# Altium schematic sheet DIfferential_Current_DAC.SchDoc
size 508 x 330 mm
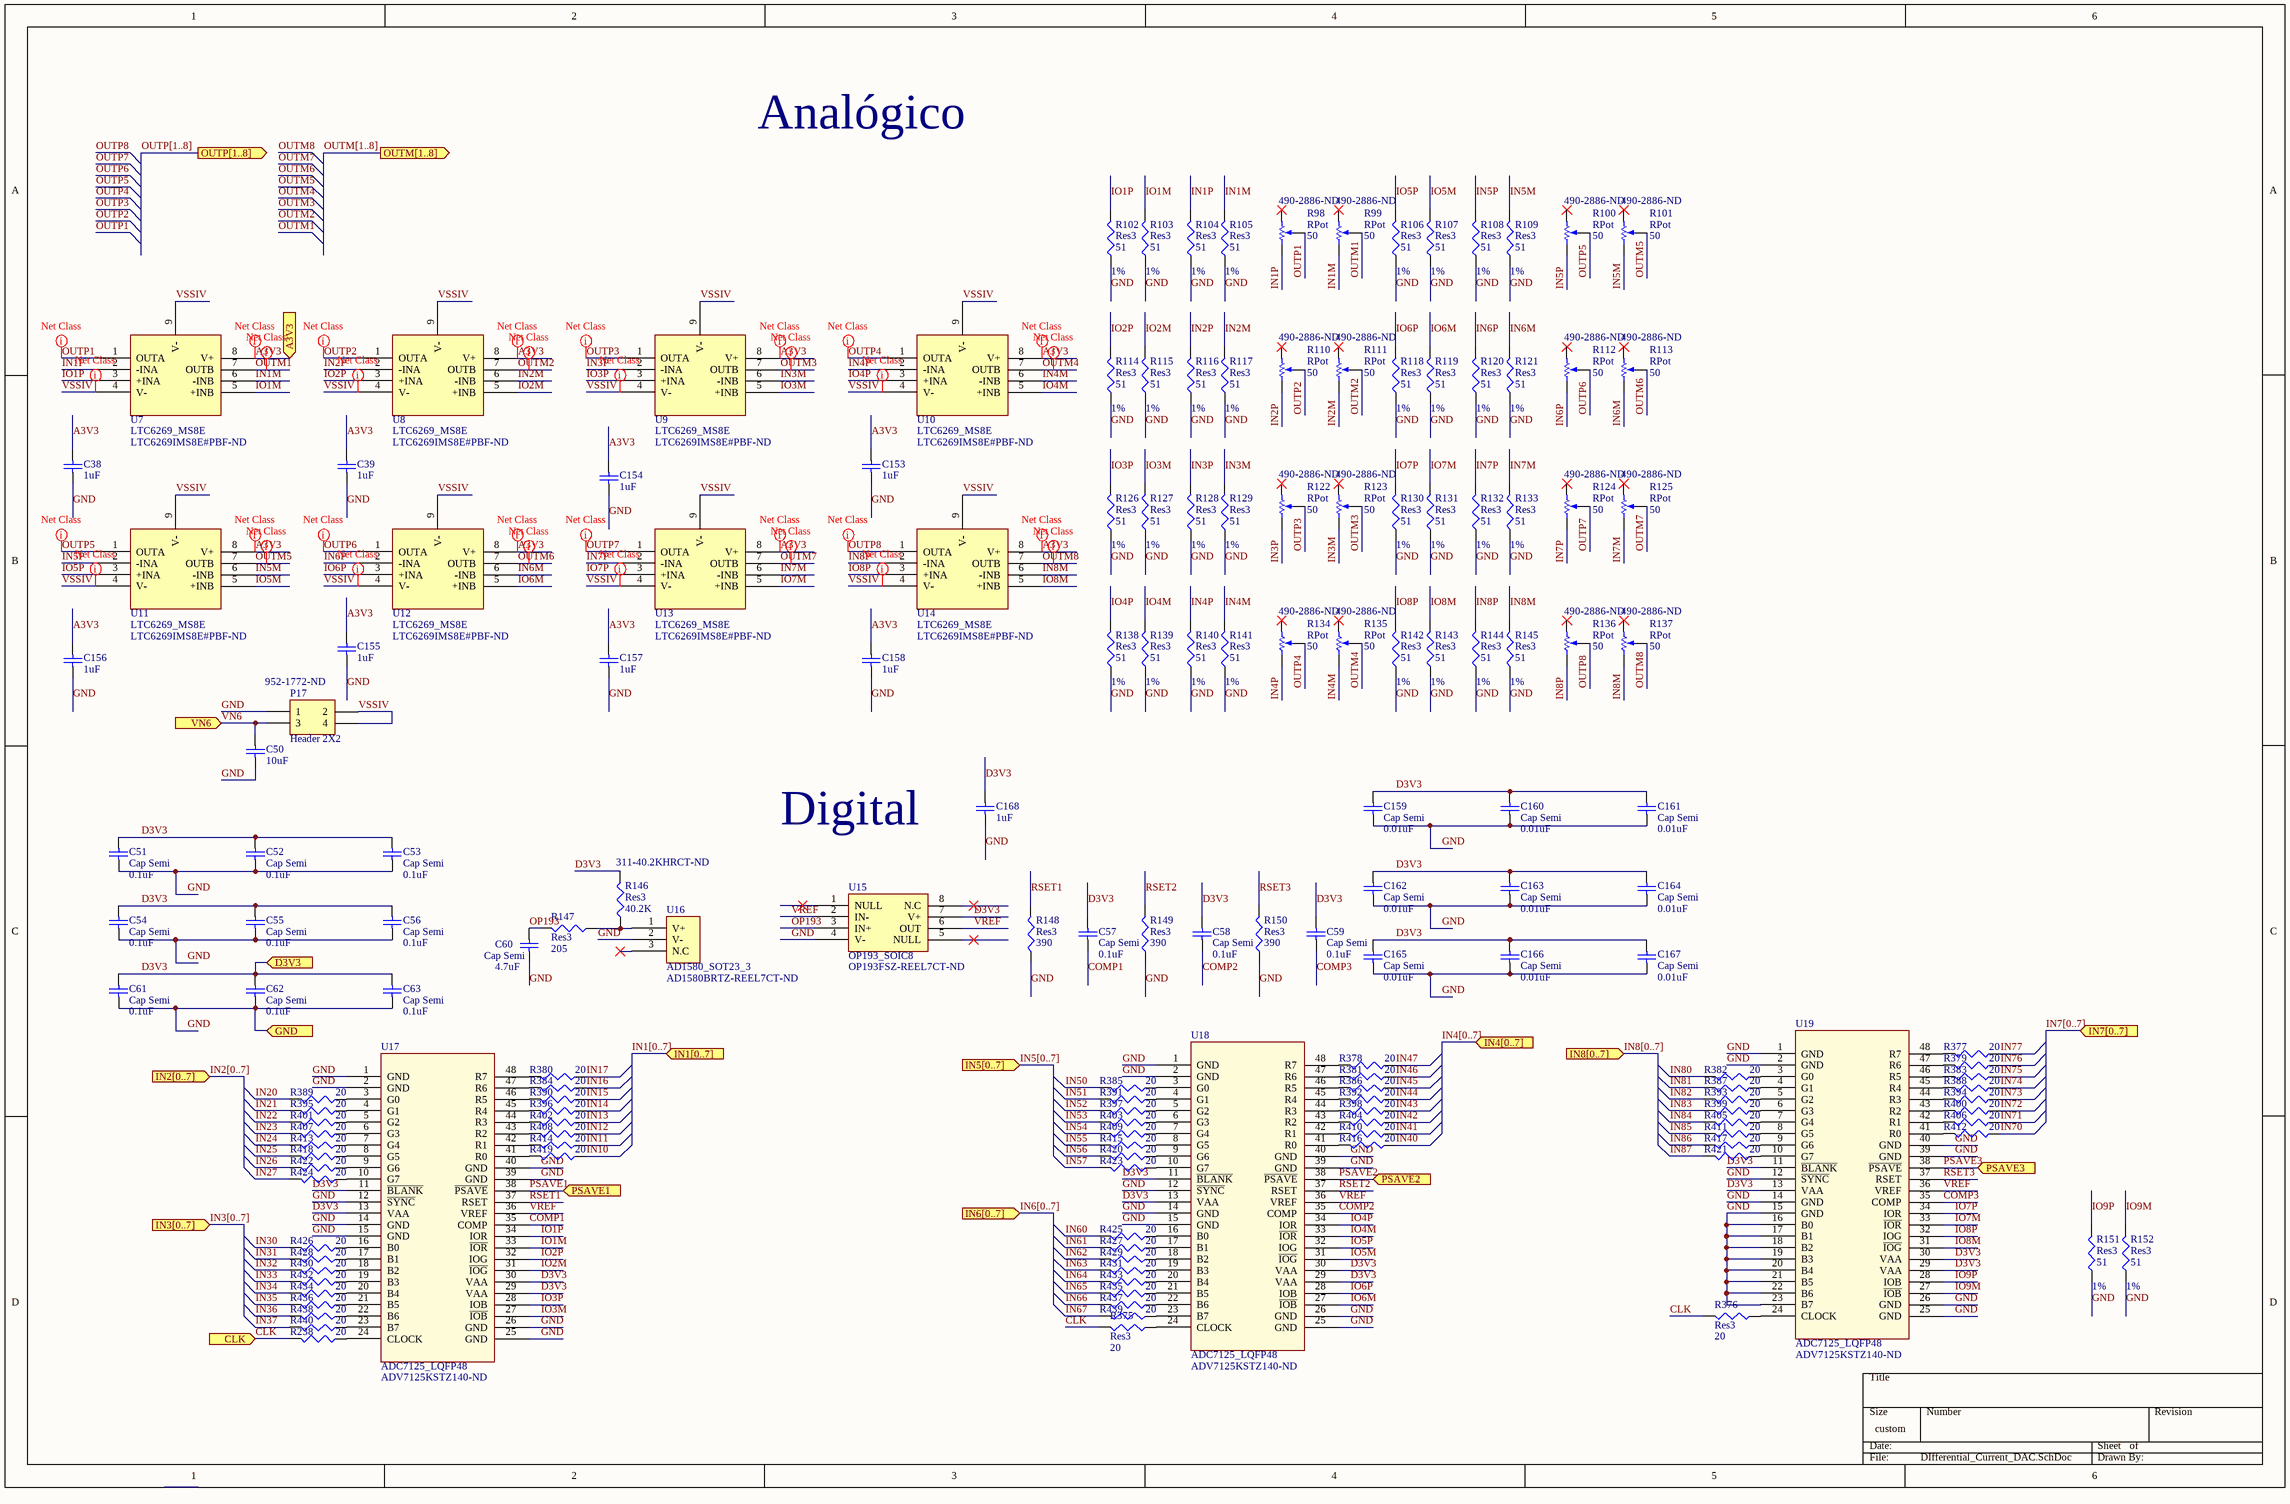
[diagram p0: DIfferential_Current_DAC.SchDoc]

## Parts
C38  value 1uF  [J1-0603]  (hidden comment: Cap)
C39  value 1uF  [J1-0603]  (hidden comment: Cap)
C50  value 10uF  [RES_0805]  (hidden comment: Cap)
C51  Cap Semi  value 0.1uF  [J1-0603]
C52  Cap Semi  value 0.1uF  [J1-0603]
C53  Cap Semi  value 0.1uF  [J1-0603]
C54  Cap Semi  value 0.1uF  [J1-0603]
C55  Cap Semi  value 0.1uF  [J1-0603]
C56  Cap Semi  value 0.1uF  [J1-0603]
C57  Cap Semi  value 0.1uF  [J1-0603]
C58  Cap Semi  value 0.1uF  [J1-0603]
C59  Cap Semi  value 0.1uF  [J1-0603]
C60  Cap Semi  value 4.7uF  [J1-0603]
C61  Cap Semi  value 0.1uF  [J1-0603]
C62  Cap Semi  value 0.1uF  [J1-0603]
C63  Cap Semi  value 0.1uF  [J1-0603]
C153  value 1uF  [J1-0603]  (hidden comment: Cap)
C154  value 1uF  [J1-0603]  (hidden comment: Cap)
C155  value 1uF  [J1-0603]  (hidden comment: Cap)
C156  value 1uF  [J1-0603]  (hidden comment: Cap)
C157  value 1uF  [J1-0603]  (hidden comment: Cap)
C158  value 1uF  [J1-0603]  (hidden comment: Cap)
C159  Cap Semi  value 0.01uF  [J1-0603]
C160  Cap Semi  value 0.01uF  [J1-0603]
C161  Cap Semi  value 0.01uF  [J1-0603]
C162  Cap Semi  value 0.01uF  [J1-0603]
C163  Cap Semi  value 0.01uF  [J1-0603]
C164  Cap Semi  value 0.01uF  [J1-0603]
C165  Cap Semi  value 0.01uF  [J1-0603]
C166  Cap Semi  value 0.01uF  [J1-0603]
C167  Cap Semi  value 0.01uF  [J1-0603]
C168  value 1uF  [J1-0603]  (hidden comment: Cap)
P17  Header 2X2  Supplier Part Number 1: 952-1772-ND  [HDR2X2]
R98  RPot  value 50  Supplier Part Number 1: 490-2886-ND  [VR5]
R99  RPot  value 50  Supplier Part Number 1: 490-2886-ND  [VR5]
R100  RPot  value 50  Supplier Part Number 1: 490-2886-ND  [VR5]
R101  RPot  value 50  Supplier Part Number 1: 490-2886-ND  [VR5]
R102  Res3  value 51  Tolerance: 1%  [J1-0603]
R103  Res3  value 51  Tolerance: 1%  [J1-0603]
R104  Res3  value 51  Tolerance: 1%  [J1-0603]
R105  Res3  value 51  Tolerance: 1%  [J1-0603]
R106  Res3  value 51  Tolerance: 1%  [J1-0603]
R107  Res3  value 51  Tolerance: 1%  [J1-0603]
R108  Res3  value 51  Tolerance: 1%  [J1-0603]
R109  Res3  value 51  Tolerance: 1%  [J1-0603]
R110  RPot  value 50  Supplier Part Number 1: 490-2886-ND  [VR5]
R111  RPot  value 50  Supplier Part Number 1: 490-2886-ND  [VR5]
R112  RPot  value 50  Supplier Part Number 1: 490-2886-ND  [VR5]
R113  RPot  value 50  Supplier Part Number 1: 490-2886-ND  [VR5]
R114  Res3  value 51  Tolerance: 1%  [J1-0603]
R115  Res3  value 51  Tolerance: 1%  [J1-0603]
R116  Res3  value 51  Tolerance: 1%  [J1-0603]
R117  Res3  value 51  Tolerance: 1%  [J1-0603]
R118  Res3  value 51  Tolerance: 1%  [J1-0603]
R119  Res3  value 51  Tolerance: 1%  [J1-0603]
R120  Res3  value 51  Tolerance: 1%  [J1-0603]
R121  Res3  value 51  Tolerance: 1%  [J1-0603]
R122  RPot  value 50  Supplier Part Number 1: 490-2886-ND  [VR5]
R123  RPot  value 50  Supplier Part Number 1: 490-2886-ND  [VR5]
R124  RPot  value 50  Supplier Part Number 1: 490-2886-ND  [VR5]
R125  RPot  value 50  Supplier Part Number 1: 490-2886-ND  [VR5]
R126  Res3  value 51  Tolerance: 1%  [J1-0603]
R127  Res3  value 51  Tolerance: 1%  [J1-0603]
R128  Res3  value 51  Tolerance: 1%  [J1-0603]
R129  Res3  value 51  Tolerance: 1%  [J1-0603]
R130  Res3  value 51  Tolerance: 1%  [J1-0603]
R131  Res3  value 51  Tolerance: 1%  [J1-0603]
R132  Res3  value 51  Tolerance: 1%  [J1-0603]
R133  Res3  value 51  Tolerance: 1%  [J1-0603]
R134  RPot  value 50  Supplier Part Number 1: 490-2886-ND  [VR5]
R135  RPot  value 50  Supplier Part Number 1: 490-2886-ND  [VR5]
R136  RPot  value 50  Supplier Part Number 1: 490-2886-ND  [VR5]
R137  RPot  value 50  Supplier Part Number 1: 490-2886-ND  [VR5]
R138  Res3  value 51  Tolerance: 1%  [J1-0603]
R139  Res3  value 51  Tolerance: 1%  [J1-0603]
R140  Res3  value 51  Tolerance: 1%  [J1-0603]
R141  Res3  value 51  Tolerance: 1%  [J1-0603]
R142  Res3  value 51  Tolerance: 1%  [J1-0603]
R143  Res3  value 51  Tolerance: 1%  [J1-0603]
R144  Res3  value 51  Tolerance: 1%  [J1-0603]
R145  Res3  value 51  Tolerance: 1%  [J1-0603]
R146  Res3  value 40.2K  Supplier Part Number 1: 311-40.2KHRCT-ND  [J1-0603]
R147  Res3  value 205  [J1-0603]
R148  Res3  value 390  [J1-0603]
R149  Res3  value 390  [J1-0603]
R150  Res3  value 390  [J1-0603]
R151  Res3  value 51  Tolerance: 1%  [J1-0603]
R152  Res3  value 51  Tolerance: 1%  [J1-0603]
R238  value 20  [R0402]  (hidden comment: Res3)
R375  Res3  value 20  [R0402]
R376  Res3  value 20  [R0402]
R377  value 20  [R0402]  (hidden comment: Res3)
R378  value 20  [R0402]  (hidden comment: Res3)
R379  value 20  [R0402]  (hidden comment: Res3)
R380  value 20  [R0402]  (hidden comment: Res3)
R381  value 20  [R0402]  (hidden comment: Res3)
R382  value 20  [R0402]  (hidden comment: Res3)
R383  value 20  [R0402]  (hidden comment: Res3)
R384  value 20  [R0402]  (hidden comment: Res3)
R385  value 20  [R0402]  (hidden comment: Res3)
R386  value 20  [R0402]  (hidden comment: Res3)
R387  value 20  [R0402]  (hidden comment: Res3)
R388  value 20  [R0402]  (hidden comment: Res3)
R389  value 20  [R0402]  (hidden comment: Res3)
R390  value 20  [R0402]  (hidden comment: Res3)
R391  value 20  [R0402]  (hidden comment: Res3)
R392  value 20  [R0402]  (hidden comment: Res3)
R393  value 20  [R0402]  (hidden comment: Res3)
R394  value 20  [R0402]  (hidden comment: Res3)
R395  value 20  [R0402]  (hidden comment: Res3)
R396  value 20  [R0402]  (hidden comment: Res3)
R397  value 20  [R0402]  (hidden comment: Res3)
R398  value 20  [R0402]  (hidden comment: Res3)
R399  value 20  [R0402]  (hidden comment: Res3)
R400  value 20  [R0402]  (hidden comment: Res3)
R401  value 20  [R0402]  (hidden comment: Res3)
R402  value 20  [R0402]  (hidden comment: Res3)
R403  value 20  [R0402]  (hidden comment: Res3)
R404  value 20  [R0402]  (hidden comment: Res3)
R405  value 20  [R0402]  (hidden comment: Res3)
R406  value 20  [R0402]  (hidden comment: Res3)
R407  value 20  [R0402]  (hidden comment: Res3)
R408  value 20  [R0402]  (hidden comment: Res3)
R409  value 20  [R0402]  (hidden comment: Res3)
R410  value 20  [R0402]  (hidden comment: Res3)
R411  value 20  [R0402]  (hidden comment: Res3)
R412  value 20  [R0402]  (hidden comment: Res3)
R413  value 20  [R0402]  (hidden comment: Res3)
R414  value 20  [R0402]  (hidden comment: Res3)
R415  value 20  [R0402]  (hidden comment: Res3)
R416  value 20  [R0402]  (hidden comment: Res3)
R417  value 20  [R0402]  (hidden comment: Res3)
R418  value 20  [R0402]  (hidden comment: Res3)
R419  value 20  [R0402]  (hidden comment: Res3)
R420  value 20  [R0402]  (hidden comment: Res3)
R421  value 20  [R0402]  (hidden comment: Res3)
R422  value 20  [R0402]  (hidden comment: Res3)
R423  value 20  [R0402]  (hidden comment: Res3)
R424  value 20  [R0402]  (hidden comment: Res3)
R425  value 20  [R0402]  (hidden comment: Res3)
R426  value 20  [R0402]  (hidden comment: Res3)
R427  value 20  [R0402]  (hidden comment: Res3)
R428  value 20  [R0402]  (hidden comment: Res3)
R429  value 20  [R0402]  (hidden comment: Res3)
R430  value 20  [R0402]  (hidden comment: Res3)
R431  value 20  [R0402]  (hidden comment: Res3)
R432  value 20  [R0402]  (hidden comment: Res3)
R433  value 20  [R0402]  (hidden comment: Res3)
R434  value 20  [R0402]  (hidden comment: Res3)
R435  value 20  [R0402]  (hidden comment: Res3)
R436  value 20  [R0402]  (hidden comment: Res3)
R437  value 20  [R0402]  (hidden comment: Res3)
R438  value 20  [R0402]  (hidden comment: Res3)
R439  value 20  [R0402]  (hidden comment: Res3)
R440  value 20  [R0402]  (hidden comment: Res3)
U7  LTC6269_MS8E  Supplier Part Number 1: LTC6269IMS8E#PBF-ND  [LTC6269_MSOP8]
U8  LTC6269_MS8E  Supplier Part Number 1: LTC6269IMS8E#PBF-ND  [LTC6269_MSOP8]
U9  LTC6269_MS8E  Supplier Part Number 1: LTC6269IMS8E#PBF-ND  [LTC6269_MSOP8]
U10  LTC6269_MS8E  Supplier Part Number 1: LTC6269IMS8E#PBF-ND  [LTC6269_MSOP8]
U11  LTC6269_MS8E  Supplier Part Number 1: LTC6269IMS8E#PBF-ND  [LTC6269_MSOP8]
U12  LTC6269_MS8E  Supplier Part Number 1: LTC6269IMS8E#PBF-ND  [LTC6269_MSOP8]
U13  LTC6269_MS8E  Supplier Part Number 1: LTC6269IMS8E#PBF-ND  [LTC6269_MSOP8]
U14  LTC6269_MS8E  Supplier Part Number 1: LTC6269IMS8E#PBF-ND  [LTC6269_MSOP8]
U15  OP193_SOIC8  Supplier Part Number 1: OP193FSZ-REEL7CT-ND  [OP193_SOIC8]
U16  AD1580_SOT23_3  Supplier Part Number 1: AD1580BRTZ-REEL7CT-ND  [AD1580_SOT23_3]
U17  ADC7125_LQFP48  Supplier Part Number 1: ADV7125KSTZ140-ND  [ADV7125_LQFP48]
U18  ADC7125_LQFP48  Supplier Part Number 1: ADV7125KSTZ140-ND  [ADV7125_LQFP48]
U19  ADC7125_LQFP48  Supplier Part Number 1: ADV7125KSTZ140-ND  [ADV7125_LQFP48]

## Ports
A3V3 (in), CLK (in), D3V3 (in), GND (in), IN1[0..7] (in), IN2[0..7] (in), IN3[0..7] (in), IN4[0..7] (in), IN5[0..7] (in), IN6[0..7] (in), IN7[0..7] (in), IN8[0..7] (in), OUTM[1..8] (out), OUTP[1..8] (out), PSAVE1 (in), PSAVE2 (in), PSAVE3 (in), VN6 (in)

## Nets
A3V3: C38.1 C39.1 C153.1 C154.1 C155.1 C156.1 C157.1 C158.1 U7.8(V+) U8.8(V+) U9.8(V+) U10.8(V+) U11.8(V+) U12.8(V+) U13.8(V+) U14.8(V+) ; port A3V3
CLK: R238.2 R375.2 R376.2 ; port CLK
COMP1: C57.1 U17.35(COMP)
COMP2: C58.1 U18.35(COMP)
COMP3: C59.1 U19.35(COMP)
D3V3: C51.1 C52.1 C53.1 C54.1 C55.1 C56.1 C57.2 C58.2 C59.2 C61.1 C62.1 C63.1 C159.1 C160.1 C161.1 C162.1 C163.1 C164.1 C165.1 C166.1 C167.1 C168.1 R146.2 U15.7(V+) U17.11(~{BLANK}) U17.13(VAA) U17.29(VAA) U17.30(VAA) U18.11(~{BLANK}) U18.13(VAA) U18.29(VAA) U18.30(VAA) U19.11(~{BLANK}) U19.13(VAA) U19.29(VAA) U19.30(VAA) ; port D3V3
GND: C38.2 C39.2 C50.2 C51.2 C52.2 C53.2 C54.2 C55.2 C56.2 C60.1 C61.2 C62.2 C63.2 C153.2 C154.2 C155.2 C156.2 C157.2 C158.2 C159.2 C160.2 C161.2 C162.2 C163.2 C164.2 C165.2 C166.2 C167.2 C168.2 P17.1 R102.1 R103.1 R104.1 R105.1 R106.1 R107.1 R108.1 R109.1 R114.1 R115.1 R116.1 R117.1 R118.1 R119.1 R120.1 R121.1 R126.1 R127.1 R128.1 R129.1 R130.1 R131.1 R132.1 R133.1 R138.1 R139.1 R140.1 R141.1 R142.1 R143.1 R144.1 R145.1 R148.1 R149.1 R150.1 R151.1 R152.1 U15.4(V-) U16.2(V-) U17.1(GND) U17.2(GND) U17.12(~{SYNC}) U17.14(GND) U17.15(GND) U17.25(GND) U17.26(GND) U17.39(GND) U17.40(GND) U18.1(GND) U18.2(GND) U18.12(~{SYNC}) U18.14(GND) U18.15(GND) U18.25(GND) U18.26(GND) U18.39(GND) U18.40(GND) U19.1(GND) U19.2(GND) U19.12(~{SYNC}) U19.14(GND) U19.15(GND) U19.16(B0) U19.17(B1) U19.18(B2) U19.19(B3) U19.20(B4) U19.21(B5) U19.22(B6) U19.23(B7) U19.25(GND) U19.26(GND) U19.39(GND) U19.40(GND) ; port GND
IN1M: R99.1(TOP) R105.2 U7.6(-INB)
IN1P: R98.1(TOP) R104.2 U7.2(-INA)
IN2M: R111.1(TOP) R117.2 U8.6(-INB)
IN2P: R110.1(TOP) R116.2 U8.2(-INA)
IN3M: R123.1(TOP) R129.2 U9.6(-INB)
IN3P: R122.1(TOP) R128.2 U9.2(-INA)
IN4M: R135.1(TOP) R141.2 U10.6(-INB)
IN4P: R134.1(TOP) R140.2 U10.2(-INA)
IN5M: R101.1(TOP) R109.2 U11.6(-INB)
IN5P: R100.1(TOP) R108.2 U11.2(-INA)
IN6M: R113.1(TOP) R121.2 U12.6(-INB)
IN6P: R112.1(TOP) R120.2 U12.2(-INA)
IN7M: R125.1(TOP) R133.2 U13.6(-INB)
IN7P: R124.1(TOP) R132.2 U13.2(-INA)
IN8M: R137.1(TOP) R145.2 U14.6(-INB)
IN8P: R136.1(TOP) R144.2 U14.2(-INA)
IN10: R419.1
IN11: R414.1
IN12: R408.1
IN13: R402.1
IN14: R396.1
IN15: R390.1
IN16: R384.1
IN17: R380.1
IN20: R389.2
IN21: R395.2
IN22: R401.2
IN23: R407.2
IN24: R413.2
IN25: R418.2
IN26: R422.2
IN27: R424.2
IN30: R426.2
IN31: R428.2
IN32: R430.2
IN33: R432.2
IN34: R434.2
IN35: R436.2
IN36: R438.2
IN37: R440.2
IN40: R416.1
IN41: R410.1
IN42: R404.1
IN43: R398.1
IN44: R392.1
IN45: R386.1
IN46: R381.1
IN47: R378.1
IN50: R385.2
IN51: R391.2
IN52: R397.2
IN53: R403.2
IN54: R409.2
IN55: R415.2
IN56: R420.2
IN57: R423.2
IN60: R425.2
IN61: R427.2
IN62: R429.2
IN63: R431.2
IN64: R433.2
IN65: R435.2
IN66: R437.2
IN67: R439.2
IN70: R412.1
IN71: R406.1
IN72: R400.1
IN73: R394.1
IN74: R388.1
IN75: R383.1
IN76: R379.1
IN77: R377.1
IN80: R382.2
IN81: R387.2
IN82: R393.2
IN83: R399.2
IN84: R405.2
IN85: R411.2
IN86: R417.2
IN87: R421.2
IO1M: R103.2 U7.5(+INB) U17.33(~{IOR})
IO1P: R102.2 U7.3(+INA) U17.34(IOR)
IO2M: R115.2 U8.5(+INB) U17.31(~{IOG})
IO2P: R114.2 U8.3(+INA) U17.32(IOG)
IO3M: R127.2 U9.5(+INB) U17.27(~{IOB})
IO3P: R126.2 U9.3(+INA) U17.28(IOB)
IO4M: R139.2 U10.5(+INB) U18.33(~{IOR})
IO4P: R138.2 U10.3(+INA) U18.34(IOR)
IO5M: R107.2 U11.5(+INB) U18.31(~{IOG})
IO5P: R106.2 U11.3(+INA) U18.32(IOG)
IO6M: R119.2 U12.5(+INB) U18.27(~{IOB})
IO6P: R118.2 U12.3(+INA) U18.28(IOB)
IO7M: R131.2 U13.5(+INB) U19.33(~{IOR})
IO7P: R130.2 U13.3(+INA) U19.34(IOR)
IO8M: R143.2 U14.5(+INB) U19.31(~{IOG})
IO8P: R142.2 U14.3(+INA) U19.32(IOG)
IO9M: R152.2 U19.27(~{IOB})
IO9P: R151.2 U19.28(IOB)
OP193: C60.2 R147.2 U15.3(IN+)
OUTM1: R99.2(TAP) U7.7(OUTB)
OUTM2: R111.2(TAP) U8.7(OUTB)
OUTM3: R123.2(TAP) U9.7(OUTB)
OUTM4: R135.2(TAP) U10.7(OUTB)
OUTM5: R101.2(TAP) U11.7(OUTB)
OUTM6: R113.2(TAP) U12.7(OUTB)
OUTM7: R125.2(TAP) U13.7(OUTB)
OUTM8: R137.2(TAP) U14.7(OUTB)
OUTP1: R98.2(TAP) U7.1(OUTA)
OUTP2: R110.2(TAP) U8.1(OUTA)
OUTP3: R122.2(TAP) U9.1(OUTA)
OUTP4: R134.2(TAP) U10.1(OUTA)
OUTP5: R100.2(TAP) U11.1(OUTA)
OUTP6: R112.2(TAP) U12.1(OUTA)
OUTP7: R124.2(TAP) U13.1(OUTA)
OUTP8: R136.2(TAP) U14.1(OUTA)
PSAVE1: U17.38(~{PSAVE}) ; port PSAVE1
PSAVE2: U18.38(~{PSAVE}) ; port PSAVE2
PSAVE3: U19.38(~{PSAVE}) ; port PSAVE3
RSET1: R148.2 U17.37(RSET)
RSET2: R149.2 U18.37(RSET)
RSET3: R150.2 U19.37(RSET)
VN6: C50.1 P17.3 ; port VN6
VREF: U15.2(IN-) U15.6(OUT) U17.36(VREF) U18.36(VREF) U19.36(VREF)
VSSIV: P17.2 P17.4 U7.4(V-) U7.9(V-) U8.4(V-) U8.9(V-) U9.4(V-) U9.9(V-) U10.4(V-) U10.9(V-) U11.4(V-) U11.9(V-) U12.4(V-) U12.9(V-) U13.4(V-) U13.9(V-) U14.4(V-) U14.9(V-)
NetR146_1: R146.1 R147.1 U16.1(V+)
NetR238_1: R238.1 U17.24(CLOCK)
NetR375_1: R375.1 U18.24(CLOCK)
NetR376_1: R376.1 U19.24(CLOCK)
NetR377_2: R377.2 U19.48(R7)
NetR378_2: R378.2 U18.48(R7)
NetR379_2: R379.2 U19.47(R6)
NetR380_2: R380.2 U17.48(R7)
NetR381_2: R381.2 U18.47(R6)
NetR382_1: R382.1 U19.3(G0)
NetR383_2: R383.2 U19.46(R5)
NetR384_2: R384.2 U17.47(R6)
NetR385_1: R385.1 U18.3(G0)
NetR386_2: R386.2 U18.46(R5)
NetR387_1: R387.1 U19.4(G1)
NetR388_2: R388.2 U19.45(R4)
NetR389_1: R389.1 U17.3(G0)
NetR390_2: R390.2 U17.46(R5)
NetR391_1: R391.1 U18.4(G1)
NetR392_2: R392.2 U18.45(R4)
NetR393_1: R393.1 U19.5(G2)
NetR394_2: R394.2 U19.44(R3)
NetR395_1: R395.1 U17.4(G1)
NetR396_2: R396.2 U17.45(R4)
NetR397_1: R397.1 U18.5(G2)
NetR398_2: R398.2 U18.44(R3)
NetR399_1: R399.1 U19.6(G3)
NetR400_2: R400.2 U19.43(R2)
NetR401_1: R401.1 U17.5(G2)
NetR402_2: R402.2 U17.44(R3)
NetR403_1: R403.1 U18.6(G3)
NetR404_2: R404.2 U18.43(R2)
NetR405_1: R405.1 U19.7(G4)
NetR406_2: R406.2 U19.42(R1)
NetR407_1: R407.1 U17.6(G3)
NetR408_2: R408.2 U17.43(R2)
NetR409_1: R409.1 U18.7(G4)
NetR410_2: R410.2 U18.42(R1)
NetR411_1: R411.1 U19.8(G5)
NetR412_2: R412.2 U19.41(R0)
NetR413_1: R413.1 U17.7(G4)
NetR414_2: R414.2 U17.42(R1)
NetR415_1: R415.1 U18.8(G5)
NetR416_2: R416.2 U18.41(R0)
NetR417_1: R417.1 U19.9(G6)
NetR418_1: R418.1 U17.8(G5)
NetR419_2: R419.2 U17.41(R0)
NetR420_1: R420.1 U18.9(G6)
NetR421_1: R421.1 U19.10(G7)
NetR422_1: R422.1 U17.9(G6)
NetR423_1: R423.1 U18.10(G7)
NetR424_1: R424.1 U17.10(G7)
NetR425_1: R425.1 U18.16(B0)
NetR426_1: R426.1 U17.16(B0)
NetR427_1: R427.1 U18.17(B1)
NetR428_1: R428.1 U17.17(B1)
NetR429_1: R429.1 U18.18(B2)
NetR430_1: R430.1 U17.18(B2)
NetR431_1: R431.1 U18.19(B3)
NetR432_1: R432.1 U17.19(B3)
NetR433_1: R433.1 U18.20(B4)
NetR434_1: R434.1 U17.20(B4)
NetR435_1: R435.1 U18.21(B5)
NetR436_1: R436.1 U17.21(B5)
NetR437_1: R437.1 U18.22(B6)
NetR438_1: R438.1 U17.22(B6)
NetR439_1: R439.1 U18.23(B7)
NetR440_1: R440.1 U17.23(B7)

Not connected (* = marked no-connect by the designer): R98 3(BOT)*; R99 3(BOT)*; R100 3(BOT)*; R101 3(BOT)*; R110 3(BOT)*; R111 3(BOT)*; R112 3(BOT)*; R113 3(BOT)*; R122 3(BOT)*; R123 3(BOT)*; R124 3(BOT)*; R125 3(BOT)*; R134 3(BOT)*; R135 3(BOT)*; R136 3(BOT)*; R137 3(BOT)*; U15 1(NULL)* 5(NULL)* 8(N.C)*; U16 3(N.C)*

## Buses and harness runs
bus IN1[0..7] = port IN1[0..7]
bus IN2[0..7] = port IN2[0..7]
bus IN3[0..7] = port IN3[0..7]
bus IN4[0..7] = port IN4[0..7]
bus IN5[0..7] = port IN5[0..7]
bus IN6[0..7] = port IN6[0..7]
bus IN7[0..7] = port IN7[0..7]
bus IN8[0..7] = port IN8[0..7]
bus OUTM[1..8] = port OUTM[1..8]
bus OUTP[1..8] = port OUTP[1..8]

## Layout directives
net class Analog_In3: A3V3, OUTM1, OUTM2, OUTM3, OUTM4, OUTM5, OUTM6, OUTM7, OUTM8, OUTP1, OUTP2, OUTP3, OUTP4, OUTP5, OUTP6, OUTP7, OUTP8, VSSIV

## Notes on the sheet
- Analógico
- (near C168) Digital

## Library data of the parts
C38 C39 C50 C153-C158 C168 = Cap: Capacitor; Published: 8-Jun-2000; LatestRevisionDate: 17-Jul-2002; LatestRevisionNote: Re-released for DXP Platform.; PackageReference: RAD-0.3; Publisher: Altium Limited; PackageDescription: Radial Cap, Thru-Hole; 2 Leads; 0.3 in Pin Spacing; Supplier 1: Digi-Key
  C38 C39 C153-C158 C168: Supplier Part Number 1: 1276-1946-1-ND
  C50: Supplier Part Number 1: 490-5523-1-ND
C51-C63 C159-C167 = Cap Semi: Capacitor (Semiconductor SIM Model); Published: 8-Jun-2000; LatestRevisionDate: 29-May-2009; LatestRevisionNote: IPC-7351 Footprint Added.; PackageReference: C1206; Publisher: Altium Limited; PackageDescription: Chip Capacitor; Supplier 1: Digi-Key
  C51-C59 C61-C63: Supplier Part Number 1: 490-1532-1-ND
  C60: Supplier Part Number 1: 1276-2087-1-ND
  C159-C167: Supplier Part Number 1: 1276-1009-1-ND
P17 = Header 2X2: Header, 2-Pin, Dual row; LatestRevisionDate: 17-Jul-2002; LatestRevisionNote: Re-released for DXP Platform.; Publisher: Altium Limited; Supplier 1: Digi-Key
R98-R101 R110-R113 R122-R125 R134-R137 = RPot: Potentiometer; Sim Note: Enter the Resistance value and the set point into parameter fields.; Set Position: 0.5; Published: 8-Jun-2000; LatestRevisionDate: 17-Jul-2002; LatestRevisionNote: Re-released for DXP Platform.; PackageReference: VR5; Publisher: Altium Limited; PackageDescription: Variable Resistor, Thru-Hole; 3 Leads; Supplier 1: Digi-Key
R102-R109 R114-R121 R126-R133 R138-R152 R238 R375-R440 = Res3: Resistor; Published: 8-Jun-2000; LatestRevisionDate: 29-May-2009; LatestRevisionNote: IPC-7351 Footprint Added.; PackageReference: J1-0603; Publisher: Altium Limited; PackageDescription: Chip Resistor; Supplier 1: Digi-Key
  R102-R109 R114-R121 R126-R133 R138-R145 R151 R152: Supplier Part Number 1: 311-51.0HRCT-ND
  R147: Supplier Part Number 1: P205HCT-ND
  R148-R150: Supplier Part Number 1: RMCF0603FT390RCT-ND
  R238 R375-R440: Supplier Part Number 1: P20JCT-ND
U7-U14 = LTC6269_MS8E: Supplier 1: Digi-Key
U15 = OP193_SOIC8: Supplier 1: Digi-Key
U16 = AD1580_SOT23_3: Supplier 1: Digi-Key
U17-U19 = ADC7125_LQFP48: Supplier 1: Digi-Key